# EAGLE design blinky (EAGLE 6.5.0)
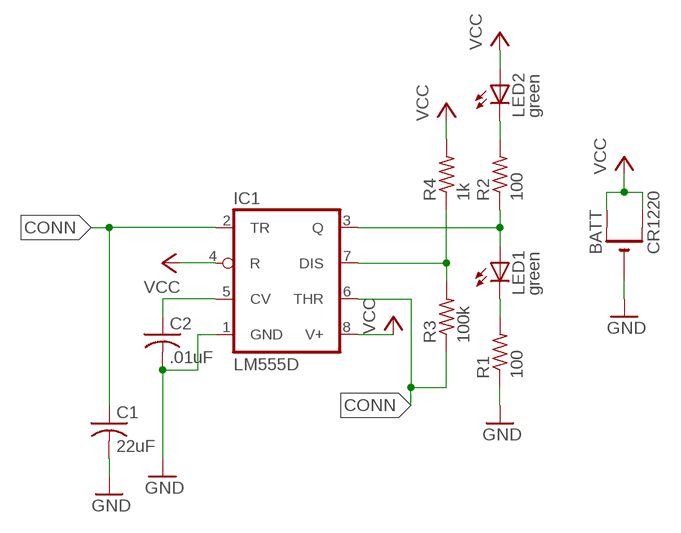
[diagram p0: schematic, sheet 1]

## Parts
BATT  CR1220  CR1220SMT  [CR1220-SMD]
C1  22uF  C-USC0805  [C0805]
C2  .01uF  C-USC0805  [C0805]
IC1  LM555D  [SO08]
LED1  green  LEDCHIPLED_0805  [CHIPLED_0805]
LED2  green  LEDCHIPLED_0805  [CHIPLED_0805]
R1  100  R-US_R0805  [R0805]
R2  100  R-US_R0805  [R0805]
R3  100k  R-US_R0805  [R0805]
R4  1k  R-US_R0805  [R0805]

## Nets
CONN: C1.1 IC1.2(TR) IC1.6(THR) R3.1
GND: BATT.- C1.2 C2.2 IC1.1(GND) R1.1
N$1: LED2.C R2.2
N$2: IC1.3(Q) LED1.A R2.1
N$3: LED1.C R1.2
N$4: IC1.7(DIS) R3.2 R4.1
N$10: C2.1 IC1.5(CV)
VCC: BATT.+$1(+) BATT.+$2(+1) IC1.4(R) IC1.8(V+) LED2.A R4.2

## Library data of the parts
BATT = adafruit:CR1220: CR1216/CR1220/CR1225 12mm 3V lithium coin cell Great for battery packup. Both SMT and THM holders. Note the THM package has the ground pads on both sides of the PCB so that the masks are the same - this reduces the cost; MPN: 3080; OC_NEWARK: 25T0433
C1 = adafruit:C-US: CAPACITOR, American symbol; MPN: 08056D226MAT2A; OC_NEWARK: 96M1423
C2 = adafruit:C-US: CAPACITOR, American symbol; MPN: GRM216R71H103KA01D; OC_NEWARK: 14T3354
IC1 = adafruit:*555: TIMER Changed DIP package to have round (not oval) pin pads http://www.ladyada.net/library/pcb/eaglelibrary.html; MPN: TLC555CD.; OC_NEWARK: 50R6850
LED1 LED2 = adafruit:LED: LED OSRAM: - CHIPLED LG R971, LG N971, LY N971, LG Q971, LY Q971, LO R971, LY R971 LH N974, LH R974 LS Q976, LO Q976, LY Q976 LO Q996 - Hyper CHIPLED LW Q18S LB Q993, LB Q99A, LB R99A - SideLED LS A670, LO A670, LY A670, LG A670, LP A670 LB A673, LV A673, LT A673, LW A673 LH A674 LY A675 LS A676, LA A676, LO A676, LY A676, LW A676 LS A679, LY A679, LG A679 - Hyper Micro SIDELED® LS Y876, LA Y876, LO Y876, LY Y876 LT Y87S - SmartLED LW L88C, LW L88S LB L89C, LB L89S, LG L890 LS L89K, LO L89K, LY L89K LS L896, LA L896, LO L896, LY L896 - TOPLED LS T670, LO T670, LY T670, LG T670, LP T670 LSG T670, LSP T670, LSY T670, LOP T670, LYG T670 LG T671, LOG T671, LSG T671 LB T673, LV T673, LT T673, LW T673 LH T674 LS T676, LA T676, LO T676, LY T676, LB T676, LH T676, LSB T676, LW T676 LB T67C, LV T67C, LT T67C, LS T67K, LO T67K, LY T67K, LW E67C LS E67B, LA E67B, LO E67B, LY E67B, LB E67C, LV E67C, LT E67C LW T67C LS T679, LY T679, LG T679 LS T770, LO T770, LY T770, LG T770, LP T770 LB T773, LV T773, LT T773, LW T773 LH T774 LS E675, LA E675, LY E675, LS T675 LS T776, LA T776, LO T776, LY T776, LB T776 LHGB T686 LT T68C, LB T68C - Hyper Mini TOPLED® LB M676 - Mini TOPLED Santana® LG M470 LS M47K, LO M47K, LY M47K Source: http://www.osram.convergy.de/; MPN: 150080GS75000; OC_NEWARK: 95W3800
R1 R2 = adafruit:R-US_: RESISTOR, American symbol; MPN: CR0805-JW-101ELF; OC_NEWARK: 06X5173
R3 = adafruit:R-US_: RESISTOR, American symbol; MF: FARNELL; MPN: MC 0.1W 0805 5% 100K; OC_NEWARK: 39K0331
R4 = adafruit:R-US_: RESISTOR, American symbol; MF: VISHAY/DALE; MPN: CRCW08051K00FKTA; OC_NEWARK: 05F1507

## Net classes
0 default: width 0.305 mm, drill 0.508 mm, clearance 0.254 mm

## Board
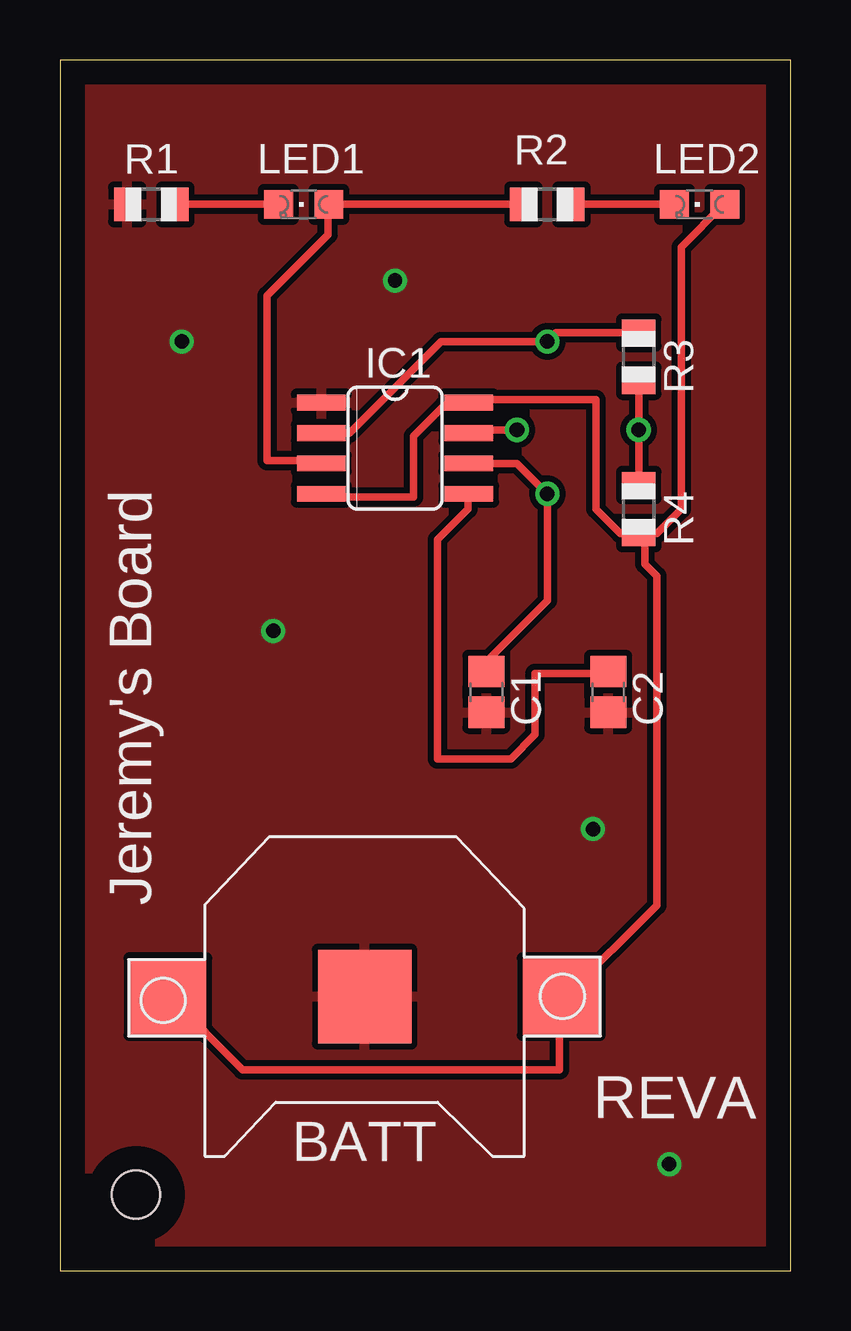
[diagram p1: board, top side]
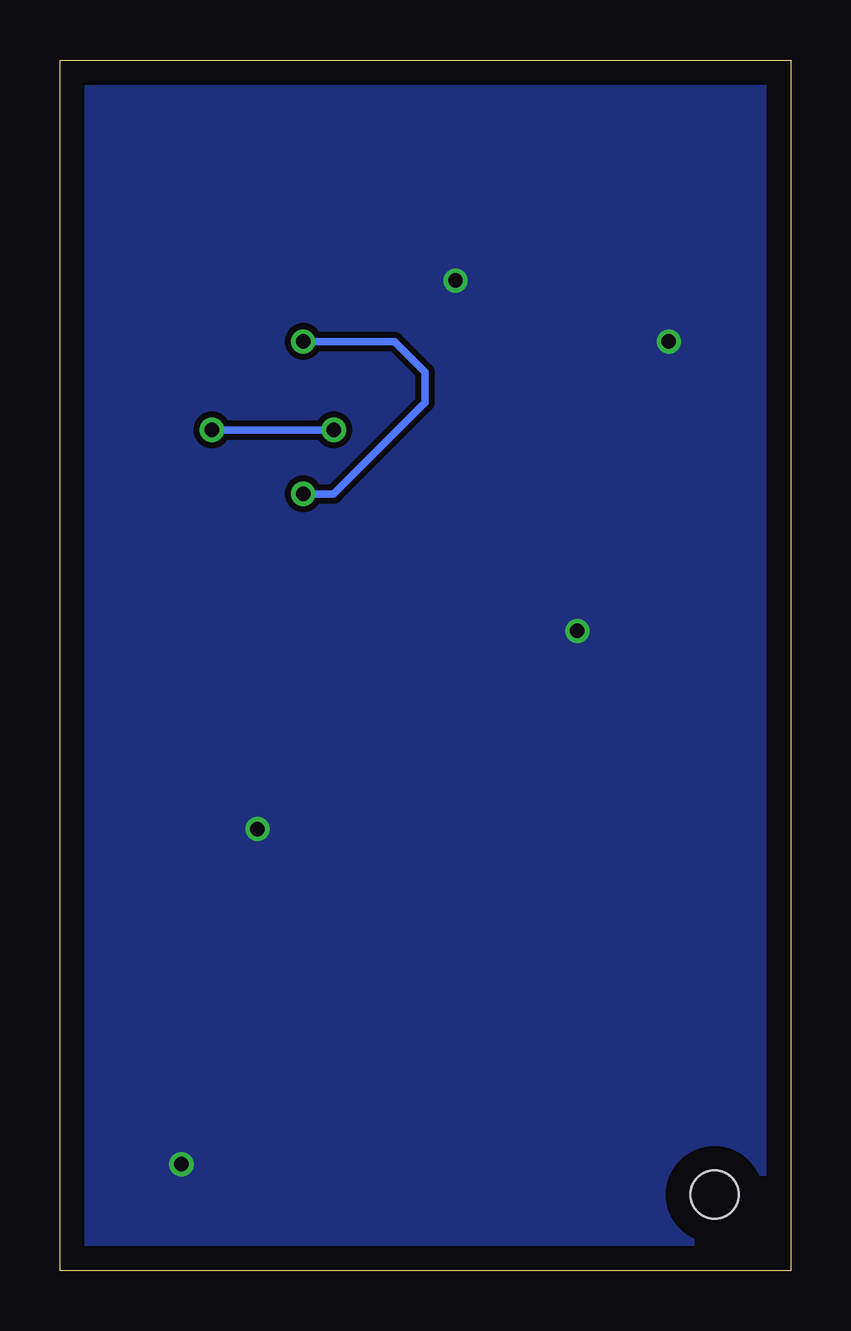
[diagram p2: board, bottom side, seen from below]

Size 30.46 x 50.47 mm. Coordinates in mm from the lower left corner, seen from the top.
Outline: 0,0 30.46,0 30.46,50.47 0,50.47 0,0
Copper layers (1*16): Top 0.035mm / dielectric 1.5mm / Bottom 0.035mm
Design rules "default": minimum track width 10mil, minimum drill 20mil, track to track 8mil, track to pad 8mil, pad to pad 8mil, via to via 8mil, smd to smd 8mil, copper to edge 40mil, drill to drill 8mil, minimum pad ring 10mil, minimum via ring 8mil, stop-mask expansion 4mil, vias tented up to drill 0mil, thermal gap 10mil
Holes 2 mm at 3.17,3.17

### Footprints (pad centres in the part's own frame; a part is rotated, then mirrored left to right if it is on the bottom)
CR1220-SMD = smd 3.2 x 3.2: +$1 -8.2,0; +$2 8.2,0 | smd 3.9 x 3.9: - 0,0
C0805 = smd 1.3 x 1.5: 1 -0.85,0; 2 0.85,0
SO08 = smd 0.66 x 2.032: 1 -1.905,-3.073; 2 -0.635,-3.073; 3 0.635,-3.073; 4 1.905,-3.073; 5 1.905,3.073; 6 0.635,3.073; 7 -0.635,3.073; 8 -1.905,3.073
CHIPLED_0805 = smd 1.2 x 1.2: A 0,-1.05; C 0,1.05
R0805 = smd 1.1 x 1.4: 1 -1,0; 2 1,0

### Placement (x,y rotation side)
BATT  12.7,11.43 180 top
C1  17.78,24.13 270 top
C2  22.86,24.13 270 top
IC1  13.97,34.29 270 top
LED1  10.16,44.45 90 top
LED2  26.67,44.45 90 top
R1  3.81,44.45 0 top
R2  20.32,44.45 0 top
R3  24.13,38.1 270 top
R4  24.13,31.75 270 top

### Tracks (layer width: path | path; a pad name or v marks a point on that pad's centre or on a via)
CONN  (via drill 0.6)
  Top 0.305: C1.1 17.78,25.4 20.32,27.94 v20.32,32.38 19.05,33.66 IC1.6 | R3.1 20.68,39.1 v20.32,38.73 15.88,38.73 12.06,34.92 IC1.2
  Bottom 0.305: v20.32,32.38 19.05,32.38 15.24,36.2 15.24,37.47 16.51,38.73 v20.32,38.73
GND  (via drill 0.6)
  other vias: 5.08,38.73 13.97,41.27 8.89,26.67 22.23,18.41 25.4,4.45
  pour Top: -1.27,52.07 -1.27,-1.27 31.75,-1.27 31.75,52.07
  pour Bottom: -0.64,50.8 -0.64,-0.64 31.11,-0.64 31.11,50.8
N$1
  Top 0.305: R2.2 LED2.C
N$2
  Top 0.305: R2.1 LED1.A 11.18,44.45 11.18,43.18 8.64,40.64 8.64,33.78 10.67,33.78 IC1.3
N$3
  Top 0.305: R1.2 LED1.C
N$4  (via drill 0.61)
  Top 0.305: R3.2 v24.13,35.05 R4.1 | v19.05,35.05 17.27,35.05 IC1.7
  Bottom 0.305: v24.13,35.05 v19.05,35.05
N$10
  Top 0.305: C2.1 22.86,24.89 19.81,24.89 19.81,22.35 18.8,21.34 15.75,21.34 15.75,30.48 17.02,31.75 17.02,32.26 IC1.5
VCC
  Top 0.305: BATT.+$2 4.57,11.43 7.62,8.38 20.83,8.38 20.83,11.43 BATT.+$1 21.08,11.43 24.89,15.24 24.89,28.96 24.38,29.46 24.38,30.73 | IC1.4 10.92,32.26 14.73,32.26 14.73,34.8 16,36.07 17.02,36.07 IC1.8 17.27,36.32 22.35,36.32 22.35,31.75 23.37,30.73 24.13,30.73 | 24.13,30.73 24.38,30.73 | 24.38,30.73 24.89,30.73 25.91,31.75 25.91,42.67 27.69,44.45 LED2.A | 24.13,30.73 R4.2 24.38,30.73

### Text on the board
tPlace: Jeremy's Board | REVA